# EAGLE design sensordrampear (EAGLE 6.2)
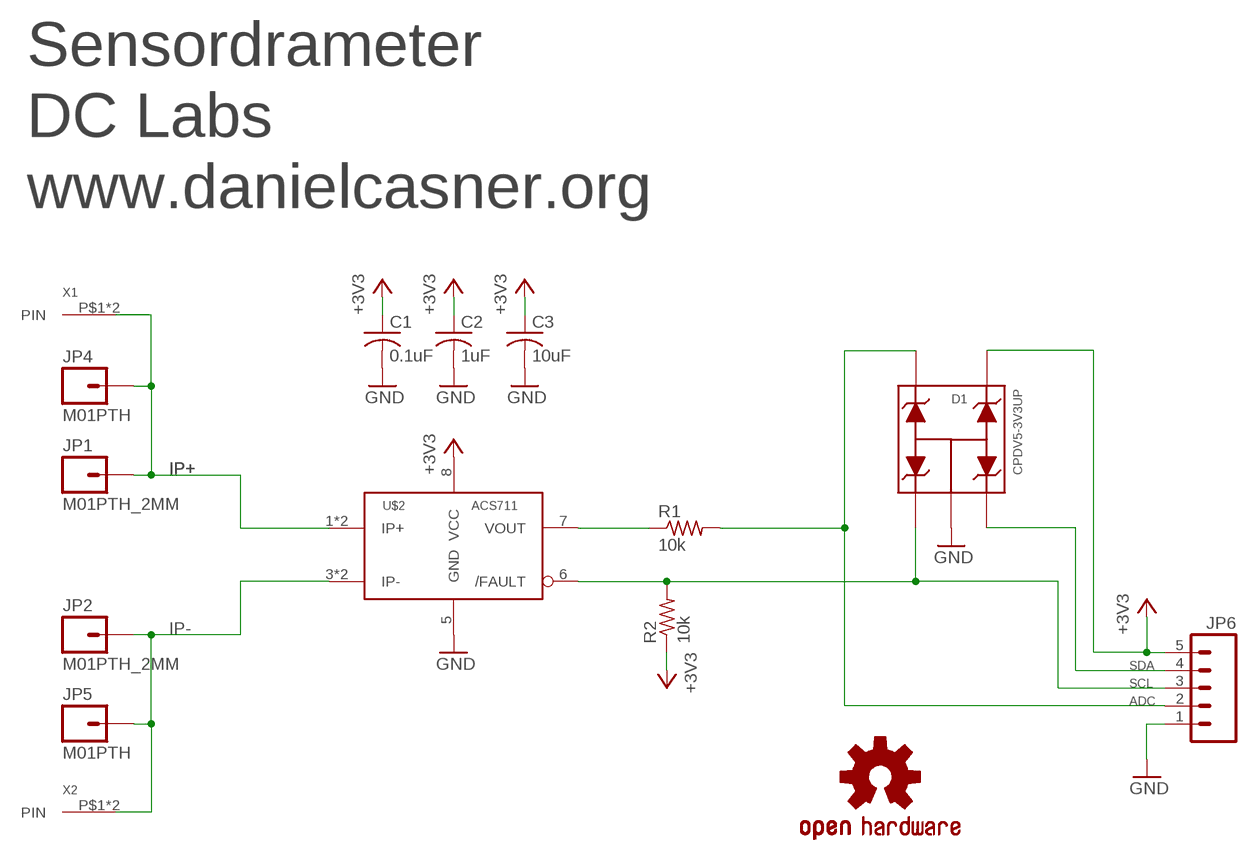
[diagram p0: schematic, sheet 1]

## Parts
C1  0.1uF  C-USC0805  [C0805]
C2  1uF  C-USC0805  [C0805]
C3  10uF  C-USC0805  [C0805]
D1  CPDV5-3V3UP  CPDV5  [SOT353]
JP1  M01PTH_2MM  [1X01_2MM]
JP2  M01PTH_2MM  [1X01_2MM]
JP4  M01PTH  [1X01]
JP5  M01PTH  [1X01]
JP6  M05PTH_LONGPADS  [1X05_LONGPADS]
R1  10k  R-US_R0402  [R0402]
R2  10k  R-US_R0402  [R0402]
U$1  OSHW-LOGOS  [OSHW-LOGO-S]
U$2  ACS711  [SO8]
X1  606X  [606X]
X2  606X  [606X]

## Nets
+3V3: C1.1 C2.1 C3.1 D1.4 JP6.5 R2.1 U$2.8(VCC)
ADC: D1.5 JP6.2 R1.2
GND: C1.2 C2.2 C3.2 D1.2 JP6.1 U$2.5(GND)
IP+: JP1.1 JP4.1 U$2.1(IP+) U$2.2(IP+) X1.P$1(PIN) X1.P$2(PIN)
IP-: JP2.1 JP5.1 U$2.3(IP-) U$2.4(IP-) X2.P$1(PIN) X2.P$2(PIN)
N$3: R1.1 U$2.7(VOUT)
SCL: D1.1 JP6.3 R2.2 U$2.6(/FAULT)
SDA: D1.3 JP6.4

## Notes on the sheet
- Sensordrameter
- DC Labs
- www.danielcasner.org

## Library data of the parts
C1-C3 = rcl:C-US: CAPACITOR, American symbol
D1 = DMM:CPDV5: SMD ESD Protection Diode
JP1 JP2 JP4 JP5 = SparkFun:M01: Header 1 Standard 1-pin 0.1" header. Use with straight break away headers (SKU : PRT-00116), right angle break away headers (PRT-00553), swiss pins (PRT-00743), machine pins (PRT-00117), and female headers (PRT-00115).
JP6 = SparkFun-Connectors:M05: Header 5 Standard 5-pin 0.1" header. Use with straight break away headers (SKU : PRT-00116), right angle break away headers (PRT-00553), swiss pins (PRT-00743), machine pins (PRT-00117), and female headers (PRT-00115). Molex polarized connector foot print use with SKU : PRT-08230 with associated crimp pins and housings.
R1 R2 = rcl:R-US_: RESISTOR, American symbol
U$1 = SparkFun-Aesthetics:OSHW-LOGO: Open Source Hardware Logo This logo indicates the piece of hardware it is found on incorporates a OSHW license and/or adheres to the definition of open source hardware found here: http://freedomdefined.org/OSHW
U$2 = DMM:ACS711: Hall Effect Linear Current Sensor with Overcurrent Fault Output for 100 V Isolation Applications
X1 X2 = DMM:606X: 606X seriese Banana Jack

## Board
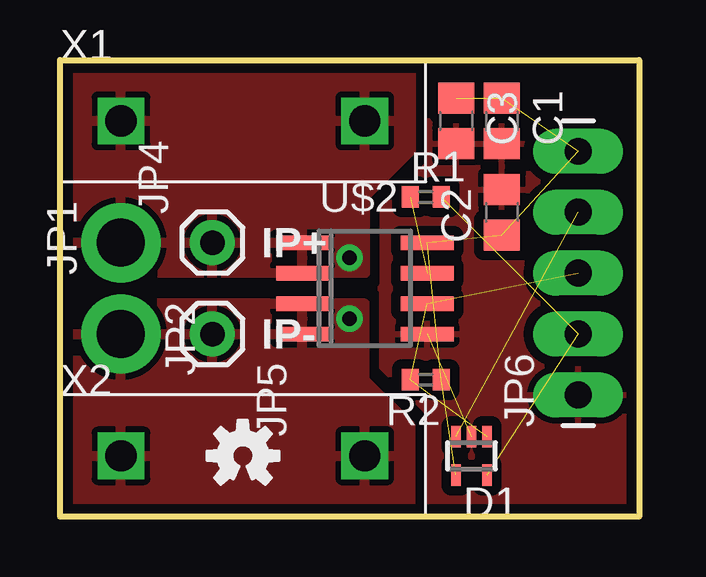
[diagram p1: board, top side]
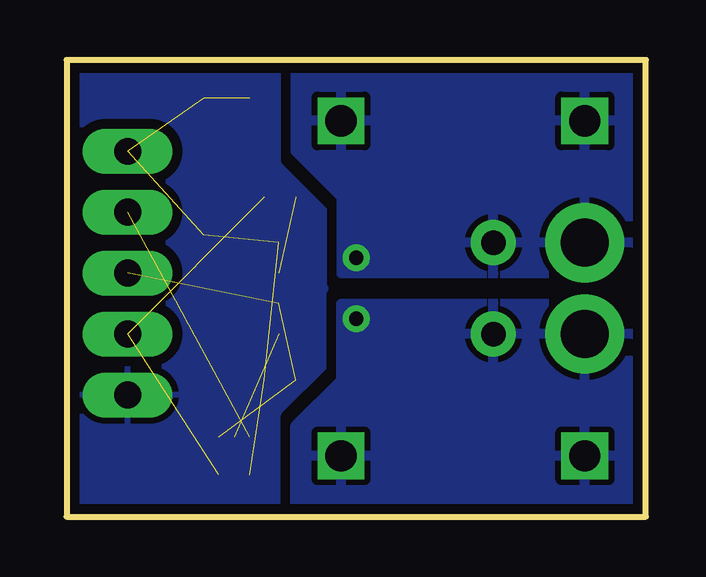
[diagram p2: board, bottom side, seen from below]

Size 24.13 x 19.05 mm. Coordinates in mm from the lower left corner, seen from the top.
Outline: 0,0 0,19.05 24.13,19.05 24.13,0 0,0
Copper layers (1*16): Top 0.035mm / dielectric 1.5mm / Bottom 0.035mm
Design rules: minimum track width 8mil, minimum drill 20mil, track to track 8mil, track to pad 8mil, pad to pad 8mil, via to via 8mil, smd to smd 8mil, copper to edge 8mil, drill to drill 8mil, minimum pad ring 12mil, minimum via ring 10mil, stop-mask expansion 4mil, vias tented up to drill 20mil, thermal gap 10mil

### Footprints (pad centres in the part's own frame; a part is rotated, then mirrored left to right if it is on the bottom)
C0805 = smd 1.3 x 1.5: 1 -0.95,0; 2 0.95,0
SOT353 = smd 0.4 x 0.9: 1 -0.65,-0.8; 2 0,-0.8; 3 0.65,-0.8; 4 0.65,0.8; 5 -0.65,0.8
1X01_2MM = drill 2 pad 3.302: 1 0,0
1X01 = drill 1.016 pad 1.88: 1 0,0
1X05_LONGPADS = drill 1.118 pad 1.88 long: 1 0,0; 2 2.54,0; 3 5.08,0; 4 7.62,0; 5 10.16,0
R0402 = smd 0.7 x 0.9: 1 -0.65,0; 2 0.65,0
SO8 = smd 0.6 x 2.2: 1 -1.905,-2.6; 2 -0.635,-2.6; 3 0.635,-2.6; 4 1.905,-2.6; 5 1.905,2.6; 6 0.635,2.6; 7 -0.635,2.6; 8 -1.905,2.6
606X = drill 1.3 square: P$1 -5.08,0; P$2 5.08,0

### Placement (x,y rotation side)
C1  18.41,16.51 270 top
C2  18.41,12.7 90 top
C3  16.51,16.51 270 top
D1  17.14,2.54 180 top
JP1  2.54,11.43 90 top
JP2  2.54,7.62 270 top
JP4  6.35,11.43 90 top
JP5  6.35,7.62 270 top
JP6  21.59,5.08 90 top
R1  15.24,13.34 0 top
R2  15.24,5.71 180 top
U$1  7.62,2.54 0 top
U$2  12.7,9.53 270 top
X1  7.62,16.51 0 top
X2  7.62,2.54 0 top

### Tracks (layer width: path | path; a pad name or v marks a point on that pad's centre or on a via)
+3V3  (6 unrouted)
ADC  (2 unrouted)
GND  (1 unrouted)
  pour Bottom (isolate 0.406, rank 4): 0,0 24.13,0 24.13,19.05 0,19.05
  pour Top (isolate 0.406, rank 4): 0,0 24.13,0 24.13,19.05 0,19.05
IP+  (via drill 0.6)
  other vias: 12.06,10.79
  pour Bottom (isolate 0.406, rank 2): 0,19.05 14.61,19.05 14.61,15.24 12.7,13.34 12.7,10.16 0,10.16
  pour Top (isolate 0.406, rank 2): 0,19.05 14.61,19.05 14.61,15.24 12.7,13.34 12.7,10.16 0,10.16
IP-  (via drill 0.6)
  other vias: 12.06,8.26
  pour Bottom (isolate 0.406, rank 2): 0,0 14.61,0 14.61,3.81 12.7,5.71 12.7,8.89 0,8.89
  pour Top (isolate 0.406, rank 2): 0,0 14.61,0 14.61,3.81 12.7,5.71 12.7,8.89 0,8.89
N$3  (1 unrouted)
SCL  (3 unrouted)
SDA  (1 unrouted)

### Text on the board
tPlace: IP+ | IP-